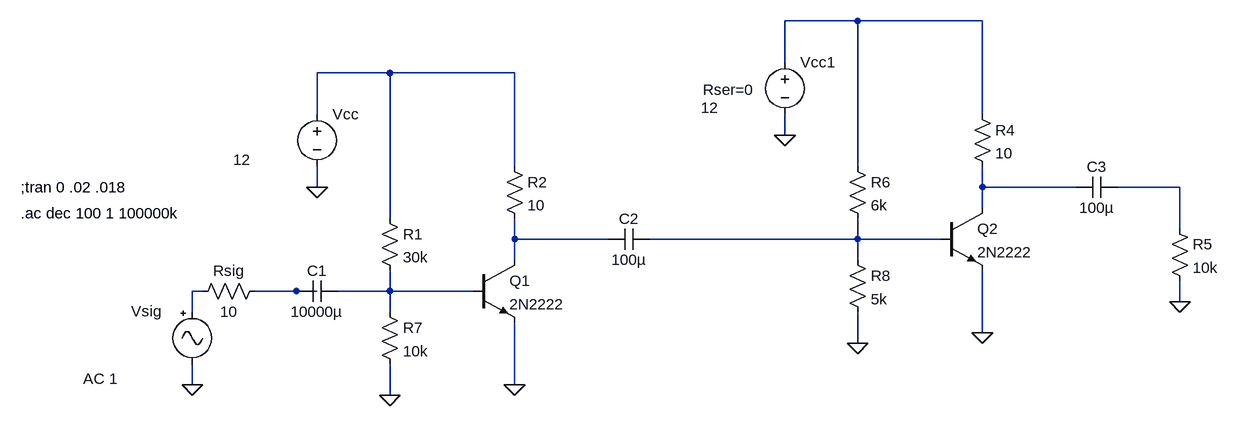
[diagram p0: schematic Emissor_Comum_Cascata_Frequencias.asc]
Emissor_Comum_Cascata_Frequencias.asc, the LTspice schematic file:
Version 4
SHEET 1 1524 948
WIRE 656 -304 544 -304
WIRE 848 -304 656 -304
WIRE 544 -240 544 -304
WIRE -64 -224 -176 -224
WIRE 128 -224 -64 -224
WIRE -176 -160 -176 -224
WIRE 848 -160 848 -304
WIRE 544 -128 544 -160
WIRE 128 -80 128 -224
WIRE 656 -80 656 -304
WIRE -176 -48 -176 -80
WIRE 848 -48 848 -80
WIRE 992 -48 848 -48
WIRE 1152 -48 1056 -48
WIRE 848 -16 848 -48
WIRE -64 0 -64 -224
WIRE 1152 16 1152 -48
WIRE 128 32 128 0
WIRE 272 32 128 32
WIRE 656 32 656 0
WIRE 656 32 336 32
WIRE 784 32 656 32
WIRE 128 64 128 32
WIRE 656 64 656 32
WIRE -352 112 -368 112
WIRE -208 112 -272 112
WIRE -176 112 -208 112
WIRE -64 112 -64 80
WIRE -64 112 -144 112
WIRE 64 112 -64 112
WIRE 1152 128 1152 96
WIRE -368 144 -368 112
WIRE -64 144 -64 112
WIRE 848 176 848 80
WIRE 656 192 656 144
WIRE -368 256 -368 224
WIRE 128 256 128 160
WIRE -64 272 -64 224
FLAG -368 256 0
FLAG -176 -48 0
FLAG 128 256 0
FLAG -64 272 0
FLAG 1152 128 0
FLAG 544 -128 0
FLAG 848 176 0
FLAG 656 192 0
SYMBOL npn 64 64 R0
SYMATTR InstName Q1
SYMATTR Value 2N2222
SYMBOL res -256 96 R90
WINDOW 0 0 56 VBottom 2
WINDOW 3 32 56 VTop 2
SYMATTR InstName Rsig
SYMATTR Value 10
SYMBOL cap -144 96 R90
WINDOW 0 0 32 VBottom 2
WINDOW 3 32 32 VTop 2
SYMATTR InstName C1
SYMATTR Value 10000µ
SYMBOL res 112 -96 R0
SYMATTR InstName R2
SYMATTR Value 10
SYMBOL cap 336 16 R90
WINDOW 0 0 32 VBottom 2
WINDOW 3 32 32 VTop 2
SYMATTR InstName C2
SYMATTR Value 100µ
SYMBOL voltage -176 -176 R0
WINDOW 3 -129 86 Left 2
SYMATTR Value 12
SYMATTR SpiceLine Rser=0
SYMATTR InstName Vcc
SYMBOL res -80 -16 R0
SYMATTR InstName R1
SYMATTR Value 30k
SYMBOL Misc\\signal -368 128 R0
WINDOW 0 -94 15 Left 2
WINDOW 3 -168 91 Left 2
WINDOW 123 -168 119 Left 2
WINDOW 39 0 0 Left 2
SYMATTR InstName Vsig
SYMATTR Value ""
SYMATTR Value2 AC 1
SYMBOL res -80 128 R0
SYMATTR InstName R7
SYMATTR Value 10k
SYMBOL npn 784 -16 R0
SYMATTR InstName Q2
SYMATTR Value 2N2222
SYMBOL res 832 -176 R0
SYMATTR InstName R4
SYMATTR Value 10
SYMBOL res 1136 0 R0
SYMATTR InstName R5
SYMATTR Value 10k
SYMBOL cap 1056 -64 R90
WINDOW 0 0 32 VBottom 2
WINDOW 3 32 32 VTop 2
SYMATTR InstName C3
SYMATTR Value 100µ
SYMBOL voltage 544 -256 R0
WINDOW 3 -129 86 Left 2
WINDOW 123 0 0 Left 2
WINDOW 39 -126 58 Left 2
SYMATTR Value 12
SYMATTR SpiceLine Rser=0
SYMATTR InstName Vcc1
SYMBOL res 640 -96 R0
SYMATTR InstName R6
SYMATTR Value 6k
SYMBOL res 640 48 R0
SYMATTR InstName R8
SYMATTR Value 5k
TEXT -632 -8 Left 2 !.ac dec 100 1 100000k
TEXT -632 -48 Left 2 !;tran 0 .02 .018

The netlist it stands for:
* Emissor_Comum_Cascata_Frequencias.asc
Q1 N005 N009 0 0 2N2222
Rsig N008 N007 10
C1 N009 N008 10000µ
R2 N002 N005 10
C2 N006 N005 100µ
Vcc N002 0 12 Rser=0
R1 N002 N009 30k
Vsig N007 0 AC 1
R7 N009 0 10k
Q2 N003 N006 0 0 2N2222
R4 N001 N003 10
R5 N004 0 10k
C3 N004 N003 100µ
Vcc1 N001 0 12 Rser=0
R6 N001 N006 6k
R8 N006 0 5k
.model NPN NPN
.model PNP PNP
.lib standard.bjt
.ac dec 100 1 100000k
;tran 0 .02 .018
.backanno
.end